# EasyEDA Pro project can-mcu.eprj, schematic host-network-display
Board Name: host-network-display; Create Date: 2026-08-07; Page Name: P1; Project Name: can-mcu; Schematic Name: host-network-display; Update Date: 2026-09-06; Company: EasyEDA.com; Page Size: A4; Version: V1.0
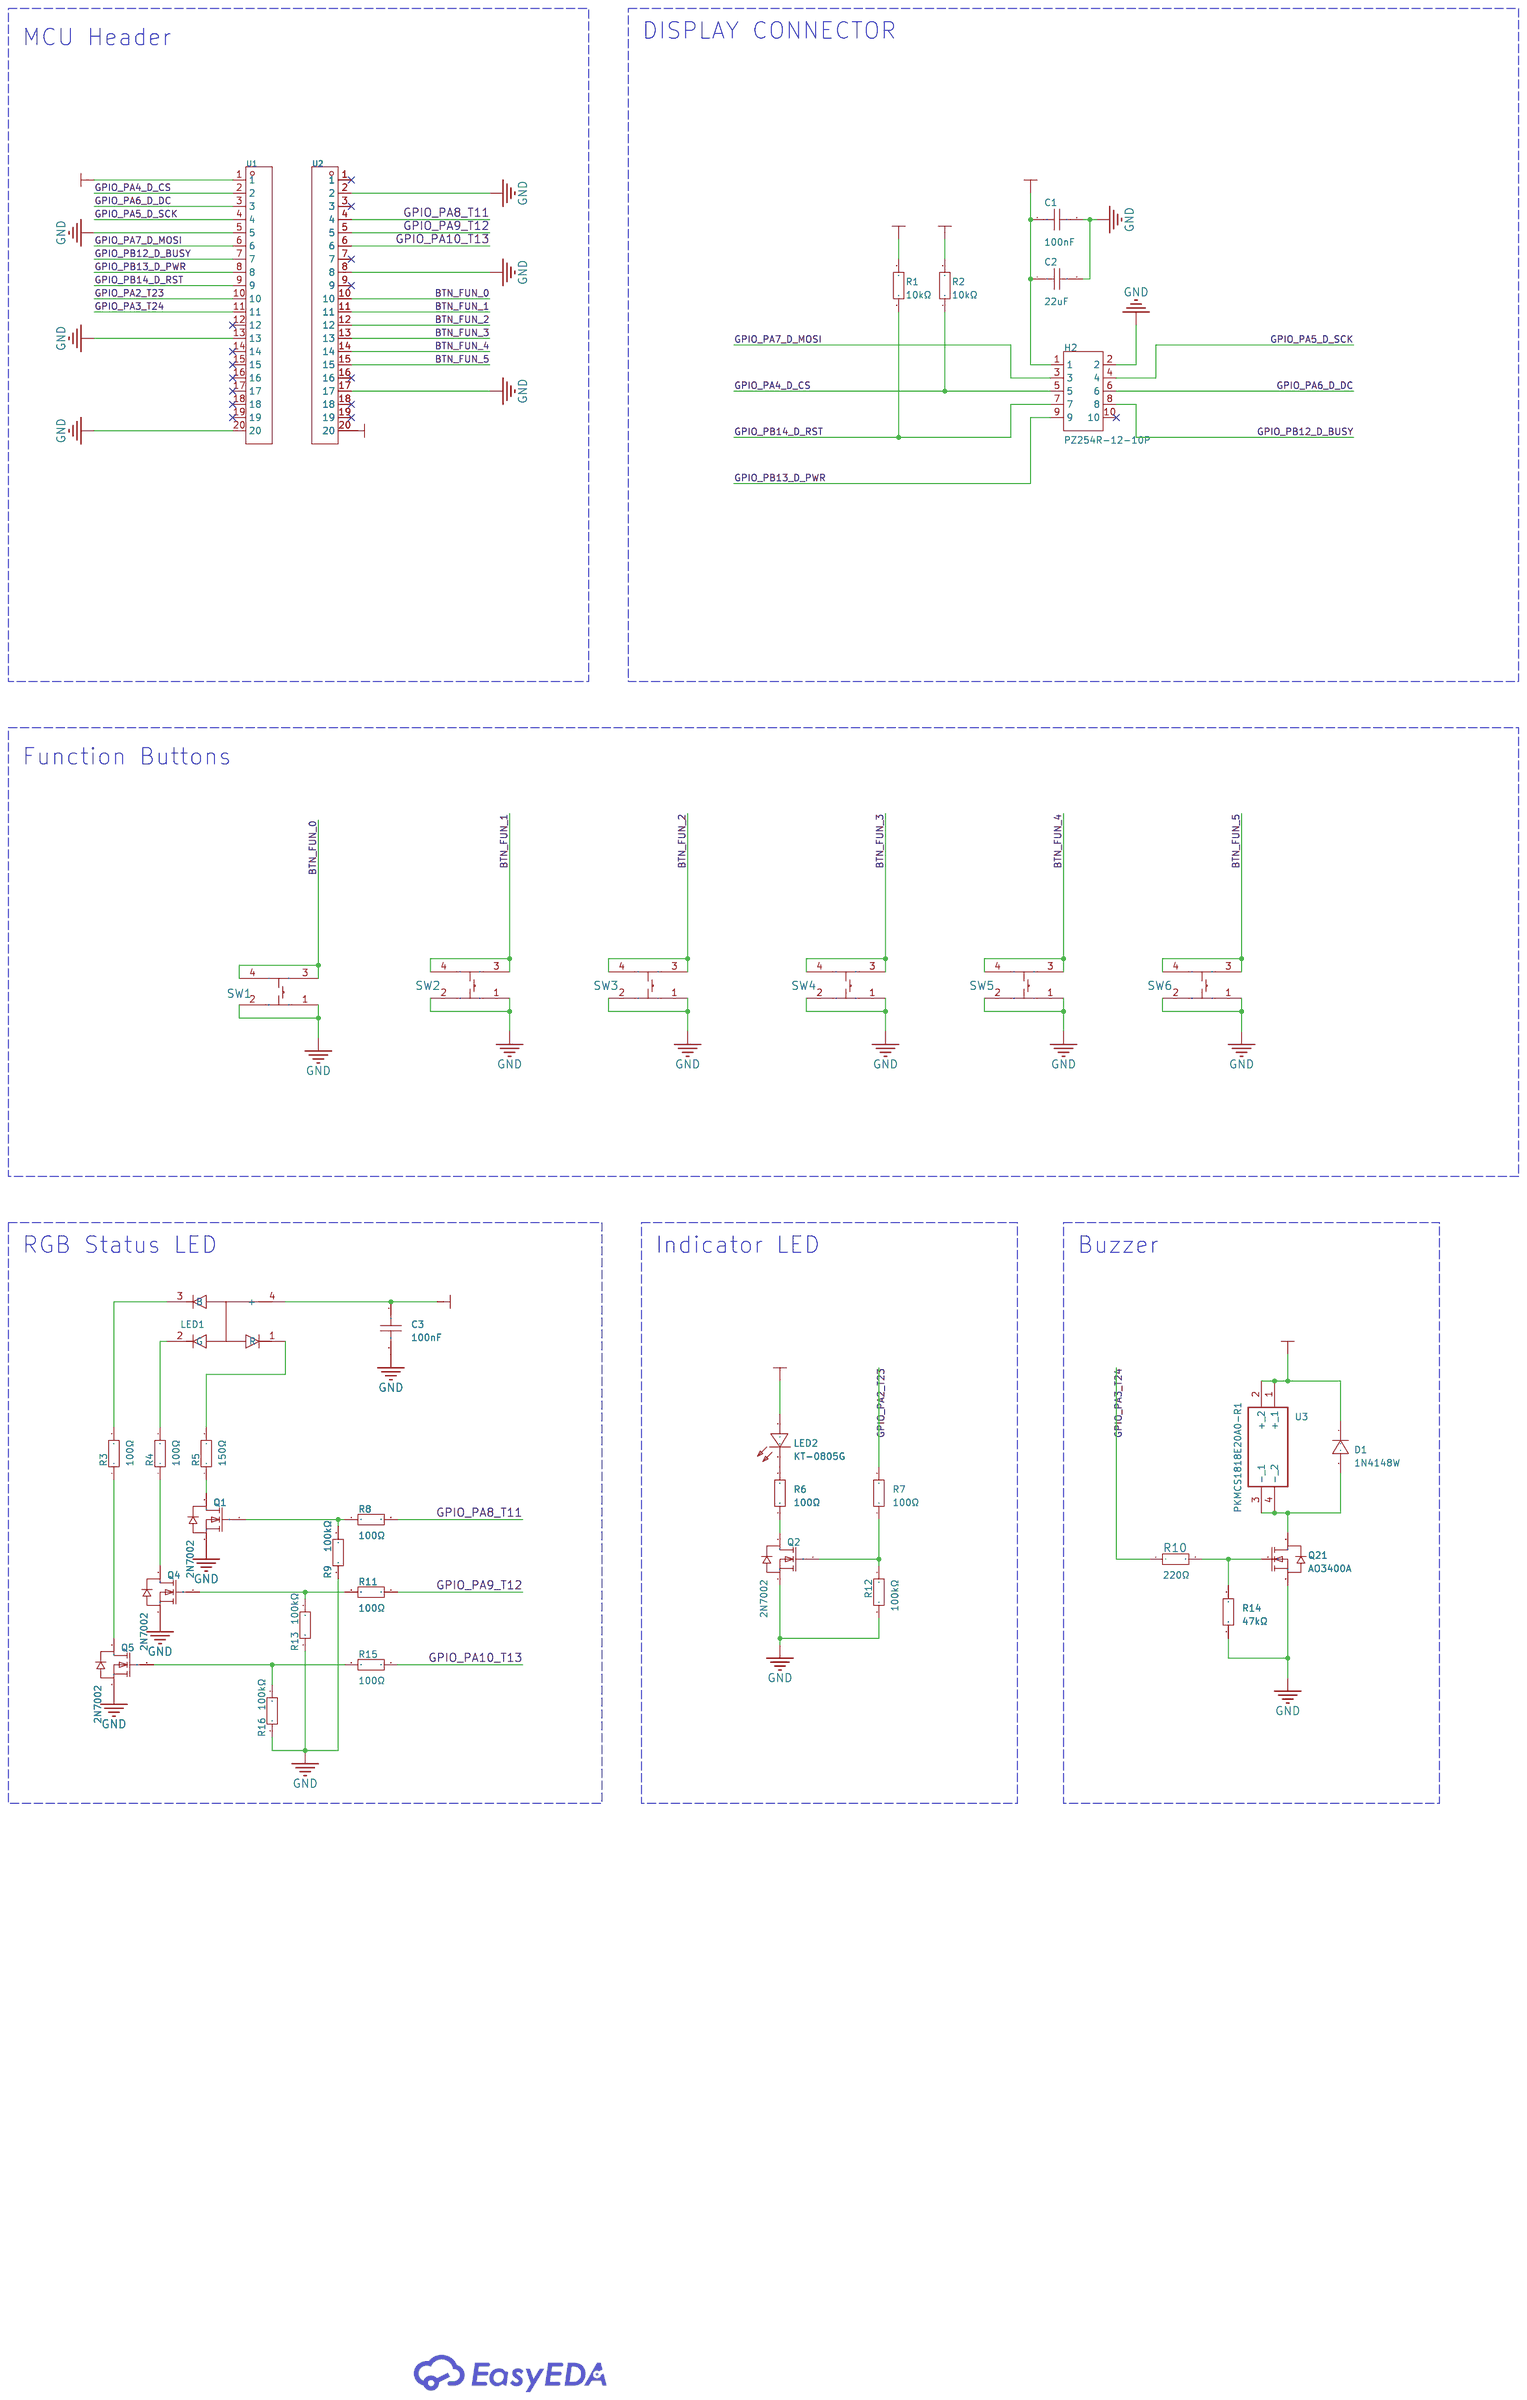
[diagram p1: schematic sheet]

## Parts
C1  100nF  [C1206]
C2  22uF  [C1206]
C3  100nF  [C1206]
D1  1N4148W  [SOD-123_L2.8-W1.8-LS3.7-RD]
H2  PZ254R-12-10P  [HDR-TH_10P-P2.54-H-M-R2-C5-S2.54]
LED1  SZYY1615RGB-B 4pin  [LED-SMD_4P-L1.6-W1.5-TR-1]
LED2  KT-0805G  [LED0805-R-RD]
Q1  2N7002  [SOT-23-3_L2.9-W1.3-P1.90-LS2.4-BR]
Q2  2N7002  [SOT-23-3_L2.9-W1.3-P1.90-LS2.4-BR]
Q4  2N7002  [SOT-23-3_L2.9-W1.3-P1.90-LS2.4-BR]
Q5  2N7002  [SOT-23-3_L2.9-W1.3-P1.90-LS2.4-BR]
Q21  AO3400A  [SOT-23-3_L2.9-W1.3-P1.90-LS2.4-BR]
R1  10kΩ  [R1206]
R2  10kΩ  [R1206]
R3  100Ω  [R1206]
R4  100Ω  [R1206]
R5  150Ω  [R1206]
R6  100Ω  [R1206]
R7  100Ω  [R1206]
R8  100Ω  [R1206]
R9  100kΩ  [R1206]
R10  220Ω  [R1206]
R11  100Ω  [R1206]
R12  100kΩ  [R1206]
R13  100kΩ  [R1206]
R14  47kΩ  [R1206]
R15  100Ω  [R1206]
R16  100kΩ  [R1206]
SW1  TS-1002S-05026C  [KEY-SMD_4P-L6.0-W6.0-P4.50-LS9.0]
SW2  TS-1002S-05026C  [KEY-SMD_4P-L6.0-W6.0-P4.50-LS9.0]
SW3  TS-1002S-05026C  [KEY-SMD_4P-L6.0-W6.0-P4.50-LS9.0]
SW4  TS-1002S-05026C  [KEY-SMD_4P-L6.0-W6.0-P4.50-LS9.0]
SW5  TS-1002S-05026C  [KEY-SMD_4P-L6.0-W6.0-P4.50-LS9.0]
SW6  TS-1002S-05026C  [KEY-SMD_4P-L6.0-W6.0-P4.50-LS9.0]
U1  KH-2.54FH-1X20P-H8.5  [HDR-TH_20P-P2.54-V-F-2]
U2  KH-2.54FH-1X20P-H8.5  [HDR-TH_20P-P2.54-V-F-2]
U3  PKMCS1818E20A0-R1  [PKMCS1818E20A0R1]

## Library data of the parts
C1 C3 = CL31B104KBCNNNC: Capacitance:100nF Tolerance:±10% Tolerance:±10% Voltage Rating:50V Temperature Coefficient:X7R; LCSC Part Name: 100nF ±10% 50V; Supplier Part: C24497; Manufacturer: SAMSUNG(三星); Supplier Footprint: 1206; JLCPCB Part Class: Basic Part; Datasheet: https://item.szlcsc.com/datasheet/CL31B104KBCNNNC/25237.html; Supplier: LCSC; Tolerance: ±10%; Voltage Rating: 50V; Temperature Coefficient: X7R
C2 = CL31B226KPHNNNE: Capacitance:22uF Tolerance:±10% Tolerance:±10% Voltage Rating:10V Temperature Coefficient:X7R; LCSC Part Name: 22uF ±10% 10V; Supplier Part: C87996; Manufacturer: SAMSUNG(三星); Supplier Footprint: 1206; JLCPCB Part Class: Extended Part; Datasheet: https://item.szlcsc.com/datasheet/CL31B226KPHNNNE/89174.html; Supplier: LCSC; Tolerance: ±10%; Voltage Rating: 10V; Temperature Coefficient: X7R
D1 = 1N4148W_C2099: LCSC Part Name: 丝印T4 100V 150mA; Supplier Part: C2099; Manufacturer: CJ(江苏长电/长晶); Supplier Footprint: SOD-123; JLCPCB Part Class: Extended Part; Datasheet: https://item.szlcsc.com/datasheet/1N4148W/2456.html; Supplier: LCSC; Diode Configuration: Standalone; Pd - Power Dissipation: 500mW; Current - Rectified: 150mA; Voltage - DC Reverse(Vr): 100V; Voltage - Forward(Vf@If): 1.25V@150mA; Non-Repetitive Peak Forward Surge Current: 2A; Reverse Leakage Current (Ir): 1uA@75V; Reverse Recovery Time (trr): 4ns; Check: true
H2 = PZ254R-12-10P: LCSC Part Name: 2x5P 间距:2.54mm 方针 弯插; Supplier Part: C492433; Manufacturer: XFCN(兴飞); Supplier Footprint: 弯插,P=2.54mm; Datasheet: https://item.szlcsc.com/datasheet/PZ254R-12-10P/502989.html; Supplier: LCSC; Pin Structure: 2x5P; Pitch: 2.54mm; Row Spacing: 2.54mm; Circluar Pins/Square Pins: Pin Header; Mounting Type: Right Angle; Number of Rows: 2; Number of Pins: 10P; Length of Mating Pin: 6mm; Insulation Height: 2.5mm; Contact Material: Brass; Operating Temperature: -40℃~+105℃; Color: Black; Check: true
LED1 = SZYY1615RGB-B 4pin: Illumination Color:Red, Green, Blue Voltage - Forward(Vf):2.4V；3.4V；3.4V Voltage - Forward(Vf):2.4V；3.4V；3.4V Power(Watts):90mW；90mW；40mW Forward Current:20mA Wavelength - Dominant:518nm~530nm；620nm~625nm；457nm~475nm Wavelength - Dominant:518nm~530nm；620n; LCSC Part Name: 1615红翠绿蓝; Supplier Part: C3029071; Manufacturer: yongyu(永裕光电); Supplier Footprint: SMD-4P,1.6x1.5mm; JLCPCB Part Class: Extended Part; Datasheet: https://item.szlcsc.com/datasheet/SZYY1615RGB-B%25204pin/3559996.html; Supplier: LCSC; Illumination Color: Red, Green, Blue; Voltage - Forward(Vf): 2.4V；3.4V；3.4V; Power(Watts): 90mW；90mW；40mW; Forward Current: 20mA; Wavelength - Dominant: 518nm~530nm；620nm~625nm；457nm~475nm; Peak Wavelength: 472nm; Lens Color: Water Clear; Luminous Intensity: 300mcd；210mcd；1150mcd; Viewing Angle: 120°; Operating Temperature: -30℃~+85℃; Check: true
LED2 = KT-0805G: Lamp Holder Type:- Illumination Color:Emerald Green Voltage - Forward(Vf):2.6V~3.1V Voltage - Forward(Vf):2.6V~3.1V Power(Watts):100mW Forward Current:5mA Wavelength - Dominant:513nm~528nm Wavelength - Dominant:513nm~528nm Peak Wavelength:525nm Diode Conf; LCSC Part Name: 0805 翠绿 高亮; Supplier Part: C2297; Manufacturer: KENTO; Supplier Footprint: 0805; JLCPCB Part Class: Basic Part; Datasheet: https://item.szlcsc.com/datasheet/KT-0805G/2670.html; Supplier: LCSC; Illumination Color: Emerald Green; Voltage - Forward(Vf): 2.6V~3.1V; Power(Watts): 100mW; Forward Current: 5mA; Wavelength - Dominant: 513nm~528nm; Peak Wavelength: 525nm; Luminous Intensity: 430mcd; Viewing Angle: 120°; Operating Temperature: -40℃~+85℃; Check: true
Q1 Q2 Q4 Q5 = 2N7002_C8545: Number:1 N-Channel Drain to Source Voltage:60V Current - Continuous Drain(Id):115mA RDS(on):5Ω@10V Pd - Power Dissipation:225mW Gate Threshold Voltage (Vgs(th)):2.5V Input Capacitance(Ciss):50pF Reverse Transfer Capacitance (Crss@Vds):5pF Operating Temper; LCSC Part Name: 1个N沟道 耐压:60V 电流:115mA; Supplier Part: C8545; Manufacturer: CJ(江苏长电/长晶); Supplier Footprint: SOT-23; JLCPCB Part Class: Basic Part; Datasheet: https://item.szlcsc.com/datasheet/2N7002/9040.html; Supplier: LCSC; Number: 1 N-Channel; Drain to Source Voltage: 60V; Current - Continuous Drain(Id): 115mA; RDS(on): 5Ω@10V; Pd - Power Dissipation: 225mW; Gate Threshold Voltage (Vgs(th)): 2.5V; Input Capacitance(Ciss): 50pF; Reverse Transfer Capacitance (Crss@Vds): 5pF; Check: true
Q21 = AO3400A: LCSC Part Name: 1个N沟道 耐压:30V 电流:5.2A; Supplier Part: C700953; Manufacturer: HUASHUO(华朔); Supplier Footprint: SOT-23; Datasheet: https://item.szlcsc.com/datasheet/AO3400A/736021.html; Supplier: LCSC; Number: 1 N-channel; Drain to Source Voltage: 30V; Current - Continuous Drain(Id): 5.2A; RDS(on): 27mΩ@4.5V; Pd - Power Dissipation: 1W; Gate Threshold Voltage (Vgs(th)): 850mV; Gate Charge(Qg): 11.7nC@4.5V; Input Capacitance(Ciss): 927pF; Reverse Transfer Capacitance (Crss@Vds): 61pF; Operating Temperature: -55℃~+150℃; Type: N-Channel; Vgs: ±12V
R1 R2 = 1206W4F1002T5E: Type:Thick Film Resistor Resistance:10kΩ Tolerance:±1% Tolerance:±1% Power(Watts):250mW Voltage-Supply(Max):200V Temperature Coefficient:±100ppm/℃ Temperature Coefficient:±100ppm/℃ Operating Temperature:-55℃~+155℃ Operating Temperature:-55℃~+155℃; LCSC Part Name: 10kΩ ±1% 250mW 厚膜电阻; Supplier Part: C17902; Manufacturer: UNI-ROYAL(厚声); Supplier Footprint: 1206; JLCPCB Part Class: Basic Part; Datasheet: https://item.szlcsc.com/datasheet/1206W4F1002T5E/18590.html; Supplier: LCSC; Type: Thick Film Resistor; Tolerance: ±1%; Power(Watts): 250mW; Voltage-Supply(Max): 200V; Temperature Coefficient: ±100ppm/℃; Operating Temperature: -55℃~+155℃
R3 R4 R6-R8 R11 R15 = 1206W4F1000T5E_C17901: Type:Thick Film Resistor Resistance:100Ω Tolerance:±1% Tolerance:±1% Power(Watts):250mW Voltage-Supply(Max):200V Temperature Coefficient:±100ppm/℃ Temperature Coefficient:±100ppm/℃ Operating Temperature:-55℃~+155℃ Operating Temperature:-55℃~+155℃; LCSC Part Name: 100Ω ±1% 250mW 厚膜电阻; Supplier Part: C17901; Manufacturer: UNI-ROYAL(厚声); Manufacturer Part: 1206W4F1000T5E; Supplier Footprint: 1206; JLCPCB Part Class: Basic Part; Datasheet: https://item.szlcsc.com/datasheet/1206W4F1000T5E/18589.html; Supplier: LCSC; Type: Thick Film Resistor; Tolerance: ±1%; Power(Watts): 250mW; Voltage-Supply(Max): 200V; Temperature Coefficient: ±100ppm/℃; Operating Temperature: -55℃~+155℃
R5 = 1206W4F1500T5E: Type:Thick Film Resistor Resistance:150Ω Tolerance:±1% Tolerance:±1% Power(Watts):250mW Voltage-Supply(Max):200V Temperature Coefficient:±100ppm/℃ Temperature Coefficient:±100ppm/℃ Operating Temperature:-55℃~+155℃ Operating Temperature:-55℃~+155℃; LCSC Part Name: 150Ω ±1% 250mW 厚膜电阻; Supplier Part: C17917; Manufacturer: UNI-ROYAL(厚声); Supplier Footprint: 1206; JLCPCB Part Class: Extended Part; Datasheet: https://item.szlcsc.com/datasheet/1206W4F1500T5E/18605.html; Supplier: LCSC; Type: Thick Film Resistor; Tolerance: ±1%; Power(Watts): 250mW; Voltage-Supply(Max): 200V; Temperature Coefficient: ±100ppm/℃; Operating Temperature: -55℃~+155℃
R9 R12 R13 R16 = 1206W4F1003T5E: Type:Thick Film Resistor Resistance:100kΩ Tolerance:±1% Tolerance:±1% Power(Watts):250mW Voltage-Supply(Max):200V Temperature Coefficient:±100ppm/℃ Temperature Coefficient:±100ppm/℃ Operating Temperature:-55℃~+155℃ Operating Temperature:-55℃~+155℃; LCSC Part Name: 100kΩ ±1% 250mW 厚膜电阻; Supplier Part: C17900; Manufacturer: UNI-ROYAL(厚声); Supplier Footprint: 1206; JLCPCB Part Class: Basic Part; Datasheet: https://item.szlcsc.com/datasheet/1206W4F1003T5E/18588.html; Supplier: LCSC; Type: Thick Film Resistor; Tolerance: ±1%; Power(Watts): 250mW; Voltage-Supply(Max): 200V; Temperature Coefficient: ±100ppm/℃; Operating Temperature: -55℃~+155℃
R10 = FRC1206J221 TS: Type:Thick Film Resistor Resistance:220Ω Tolerance:±5% Tolerance:±5% Power(Watts):250mW Voltage-Supply(Max):200V Temperature Coefficient:±100ppm/℃ Temperature Coefficient:±100ppm/℃ Operating Temperature:-55℃~+155℃ Operating Temperature:-55℃~+155℃; LCSC Part Name: 220Ω ±5% 250mW 厚膜电阻; Supplier Part: C2933785; Manufacturer: FOJAN(富捷); Supplier Footprint: 1206; JLCPCB Part Class: Extended Part; Datasheet: https://item.szlcsc.com/datasheet/FRC1206J221%2520TS/3279887.html; Supplier: LCSC; Type: Thick Film Resistor; Tolerance: ±5%; Power(Watts): 250mW; Voltage-Supply(Max): 200V; Temperature Coefficient: ±100ppm/℃; Operating Temperature: -55℃~+155℃; Check: true
R14 = RC1206FR-0747KL: Type:Thick Film Resistor Resistance:47kΩ Tolerance:±1% Tolerance:±1% Power(Watts):250mW Voltage-Supply(Max):200V Temperature Coefficient:±100ppm/℃ Temperature Coefficient:±100ppm/℃ Operating Temperature:-55℃~+155℃ Operating Temperature:-55℃~+155℃; LCSC Part Name: 厚膜电阻 47kΩ ±1% 250mW; Supplier Part: C137270; Manufacturer: YAGEO(国巨); Supplier Footprint: 1206; JLCPCB Part Class: Extended Part; Datasheet: https://item.szlcsc.com/datasheet/RC1206FR-0747KL/148586.html; Supplier: LCSC; Type: Thick Film Resistor; Tolerance: ±1%; Power(Watts): 250mW; Voltage-Supply(Max): 200V; Temperature Coefficient: ±100ppm/℃; Operating Temperature: -55℃~+155℃; Check: true
SW1-SW6 = TS-1002S-05026C: Circuit:SPST Actuator Style:Round Button Operating Force:2.6N Mounting Type:Surface Mount,Vertical Length:6mm Width:6mm Switch Height:5mm with Bracket:Without Bracket Contact Current:50mA Voltage Rating:12V Actuator/Cap Color:Black With Lamp:- Termination; LCSC Part Name: 6*6*5mm 立贴 轻触开关; Supplier Part: C455110; Manufacturer: XUNPU(讯普); Supplier Footprint: SMD-4P,6x6mm; JLCPCB Part Class: Extended Part; Datasheet: https://item.szlcsc.com/datasheet/TS-1002S-05026C/457515.html; Supplier: LCSC; Circuit: SPST; Actuator Style: Round Button; Mounting Type: Surface Mount,Vertical; Length: 6mm; Width: 6mm; Switch Height: 5mm; Contact Current: 50mA; Voltage Rating: 12V; Operating Force: 2.6N; with Bracket: Without Bracket; Actuator/Cap Color: Black; Termination Style: Gull Wing; Check: true
U1 U2 = KH-2.54FH-1X20P-H8.5: LCSC Part Name: 间距:2.54mm 1x20P 直插; Supplier Part: C2905423; Manufacturer: kinghelm(金航标); Supplier Footprint: 插件,P=2.54mm; Datasheet: https://item.szlcsc.com/datasheet/KH-2.54FH-1X20P-H8.5/3175197.html; Supplier: LCSC; Holes Structure: 1x20P; Pitch: 2.54mm; Circular Hole / Square Hole: Square Hole; Mounting Type: Through Hole; Number of Rows: 1; Number of Positions: 20P; Current Rating: 3A; Holes Direction: Top; Insulation Height: 8.5mm; Operating Temperature: -40℃~+105℃; Check: true
U3 = PKMCS1818E20A0-R1: Height: 8mm; Check: true

## Nets
+3V3: C1.1 C2.1 C3.1 H2.1 LED1.4(+) LED2.1(A) R1.2 R2.2 U1.1
+12V: D1.1(K) U2.20 U3.1(+) U3.2(+)
GND: C1.2 C2.2 C3.2 H2.2 Q1.2(S) Q2.2(S) Q4.2(S) Q5.2(S) Q21.2(S) R9.2 R12.2 R13.2 R14.1 R16.2 SW1.1 SW1.2 SW2.1 SW2.2 SW3.1 SW3.2 SW4.1 SW4.2 SW5.1 SW5.2 SW6.1 SW6.2 U1.5 U1.13 U1.20 U2.2 U2.8 U2.17
BTN_FUN_0: SW1.3 SW1.4 U2.10
BTN_FUN_1: SW2.3 SW2.4 U2.11
BTN_FUN_2: SW3.3 SW3.4 U2.12
BTN_FUN_3: SW4.3 SW4.4 U2.13
BTN_FUN_4: SW5.3 SW5.4 U2.14
BTN_FUN_5: SW6.3 SW6.4 U2.15
GPIO_PA2_T23: R7.2 U1.10
GPIO_PA3_T24: R10.1 U1.11
GPIO_PA4_D_CS: H2.5 R2.1 U1.2
GPIO_PA5_D_SCK: H2.4 U1.4
GPIO_PA6_D_DC: H2.6 U1.3
GPIO_PA7_D_MOSI: H2.3 U1.6
GPIO_PA8_T11: R8.2 U2.4
GPIO_PA9_T12: R11.1 U2.5
GPIO_PA10_T13: R15.1 U2.6
GPIO_PB12_D_BUSY: H2.8 U1.7
GPIO_PB13_D_PWR: H2.9 U1.8
GPIO_PB14_D_RST: H2.7 R1.1 U1.9
$1N6640: Q5.1(G) R15.2 R16.1
$1N6642: Q4.1(G) R11.2 R13.1
$1N6643: Q1.1(G) R8.1 R9.1
$1N6645: Q5.3(D) R3.1
$1N6646: Q4.3(D) R4.1
$1N6648: LED1.2(G) R4.2
$1N6649: LED1.3(B) R3.2
$1N6650: Q1.3(D) R5.1
$1N61445: Q2.1(G) R7.1 R12.1
$1N61447: Q2.3(D) R6.1
$1N63206: LED1.1(R) R5.2
$1N82421: D1.2(A) Q21.3(D) U3.3(-_1) U3.4(-_2)
$1N82425: Q21.1(G) R10.2 R14.2
$1N83824: LED2.2(K) R6.2

Not connected (* = marked no-connect by the designer): H2 10*; U1 12* 14* 15* 16* 17* 18* 19*; U2 1* 3* 7* 9* 16* 18* 19*

## Notes on the sheet
- DISPLAY CONNECTOR
- MCU Header
- Function Buttons
- RGB Status LED
- Indicator LED
- Buzzer
